# EAGLE design LIXIE_II (EAGLE 7.6.0)
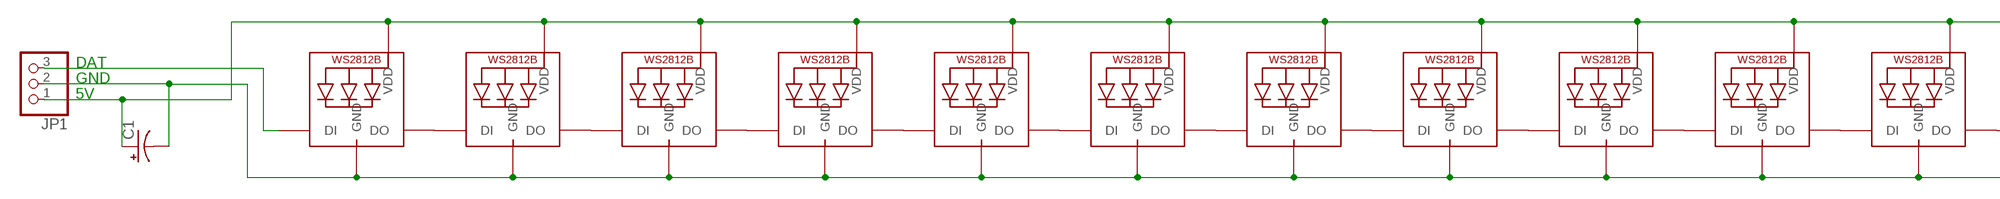
[diagram p0: schematic, sheet 1, part 1 of 2]
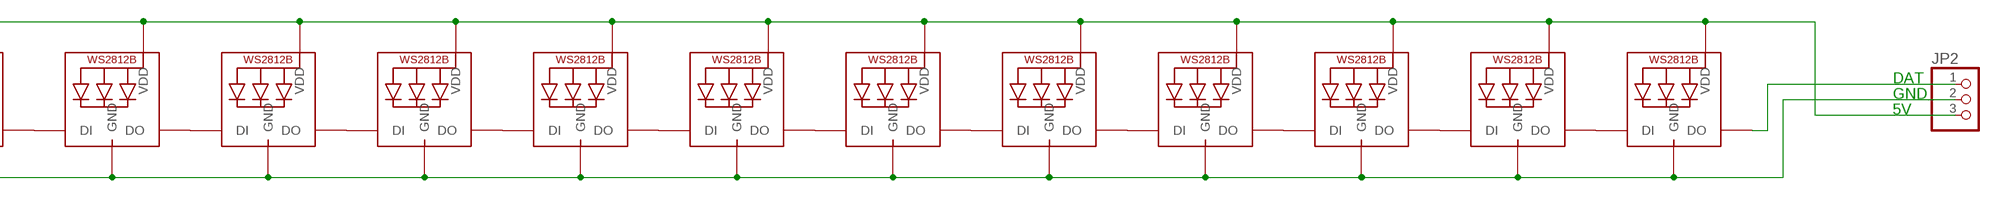
[diagram p1: schematic, sheet 1, part 2 of 2]

## Parts
C1  CPOL-USE5-10.5  [E5-10,5]
JP1  PINHD-1X3  [1X03]
JP2  PINHD-1X3  [1X03]
LED1  WS2812B_5050N  [WS2812B-NARROW]
LED2  WS2812B_5050N  [WS2812B-NARROW]
LED3  WS2812B_5050N  [WS2812B-NARROW]
LED4  WS2812B_5050N  [WS2812B-NARROW]
LED5  WS2812B_5050N  [WS2812B-NARROW]
LED6  WS2812B_5050N  [WS2812B-NARROW]
LED7  WS2812B_5050N  [WS2812B-NARROW]
LED8  WS2812B_5050N  [WS2812B-NARROW]
LED9  WS2812B_5050N  [WS2812B-NARROW]
LED10  WS2812B_5050N  [WS2812B-NARROW]
LED11  WS2812B_5050N  [WS2812B-NARROW]
LED12  WS2812B_5050N  [WS2812B-NARROW]
LED13  WS2812B_5050N  [WS2812B-NARROW]
LED14  WS2812B_5050N  [WS2812B-NARROW]
LED15  WS2812B_5050N  [WS2812B-NARROW]
LED16  WS2812B_5050N  [WS2812B-NARROW]
LED17  WS2812B_5050N  [WS2812B-NARROW]
LED18  WS2812B_5050N  [WS2812B-NARROW]
LED19  WS2812B_5050N  [WS2812B-NARROW]
LED20  WS2812B_5050N  [WS2812B-NARROW]
LED21  WS2812B_5050N  [WS2812B-NARROW]
LED22  WS2812B_5050N  [WS2812B-NARROW]

## Nets
5V: C1.+ JP1.1 JP2.3 LED1.1-VDD(VDD) LED2.1-VDD(VDD) LED3.1-VDD(VDD) LED4.1-VDD(VDD) LED5.1-VDD(VDD) LED6.1-VDD(VDD) LED7.1-VDD(VDD) LED8.1-VDD(VDD) LED9.1-VDD(VDD) LED10.1-VDD(VDD) LED11.1-VDD(VDD) LED12.1-VDD(VDD) LED13.1-VDD(VDD) LED14.1-VDD(VDD) LED15.1-VDD(VDD) LED16.1-VDD(VDD) LED17.1-VDD(VDD) LED18.1-VDD(VDD) LED19.1-VDD(VDD) LED20.1-VDD(VDD) LED21.1-VDD(VDD) LED22.1-VDD(VDD)
GND: C1.- JP1.2 JP2.2 LED1.3-GND(GND) LED2.3-GND(GND) LED3.3-GND(GND) LED4.3-GND(GND) LED5.3-GND(GND) LED6.3-GND(GND) LED7.3-GND(GND) LED8.3-GND(GND) LED9.3-GND(GND) LED10.3-GND(GND) LED11.3-GND(GND) LED12.3-GND(GND) LED13.3-GND(GND) LED14.3-GND(GND) LED15.3-GND(GND) LED16.3-GND(GND) LED17.3-GND(GND) LED18.3-GND(GND) LED19.3-GND(GND) LED20.3-GND(GND) LED21.3-GND(GND) LED22.3-GND(GND)
N$1: JP1.3 LED1.4-DIN(DI)
N$4: LED1.2-DOUT(DO) LED2.4-DIN(DI)
N$5: LED2.2-DOUT(DO) LED3.4-DIN(DI)
N$6: LED3.2-DOUT(DO) LED4.4-DIN(DI)
N$7: LED4.2-DOUT(DO) LED5.4-DIN(DI)
N$8: LED5.2-DOUT(DO) LED6.4-DIN(DI)
N$9: LED6.2-DOUT(DO) LED7.4-DIN(DI)
N$10: LED7.2-DOUT(DO) LED8.4-DIN(DI)
N$11: LED8.2-DOUT(DO) LED9.4-DIN(DI)
N$12: LED9.2-DOUT(DO) LED10.4-DIN(DI)
N$13: LED10.2-DOUT(DO) LED11.4-DIN(DI)
N$14: LED11.2-DOUT(DO) LED12.4-DIN(DI)
N$15: LED12.2-DOUT(DO) LED13.4-DIN(DI)
N$16: LED13.2-DOUT(DO) LED14.4-DIN(DI)
N$17: LED14.2-DOUT(DO) LED15.4-DIN(DI)
N$18: LED15.2-DOUT(DO) LED16.4-DIN(DI)
N$19: LED16.2-DOUT(DO) LED17.4-DIN(DI)
N$20: LED17.2-DOUT(DO) LED18.4-DIN(DI)
N$21: LED18.2-DOUT(DO) LED19.4-DIN(DI)
N$22: LED19.2-DOUT(DO) LED20.4-DIN(DI)
N$23: LED20.2-DOUT(DO) LED21.4-DIN(DI)
N$24: LED21.2-DOUT(DO) LED22.4-DIN(DI)
N$26: JP2.1 LED22.2-DOUT(DO)

## Notes on the sheet
- DAT
- GND | DAT
- 5V | GND
- 5V

## Library data of the parts
C1 = rcl:CPOL-US: POLARIZED CAPACITOR, American symbol
JP1 JP2 = pinhead:PINHD-1X3: PIN HEADER
LED1-LED22 = adafruit:WS2812B

## Board
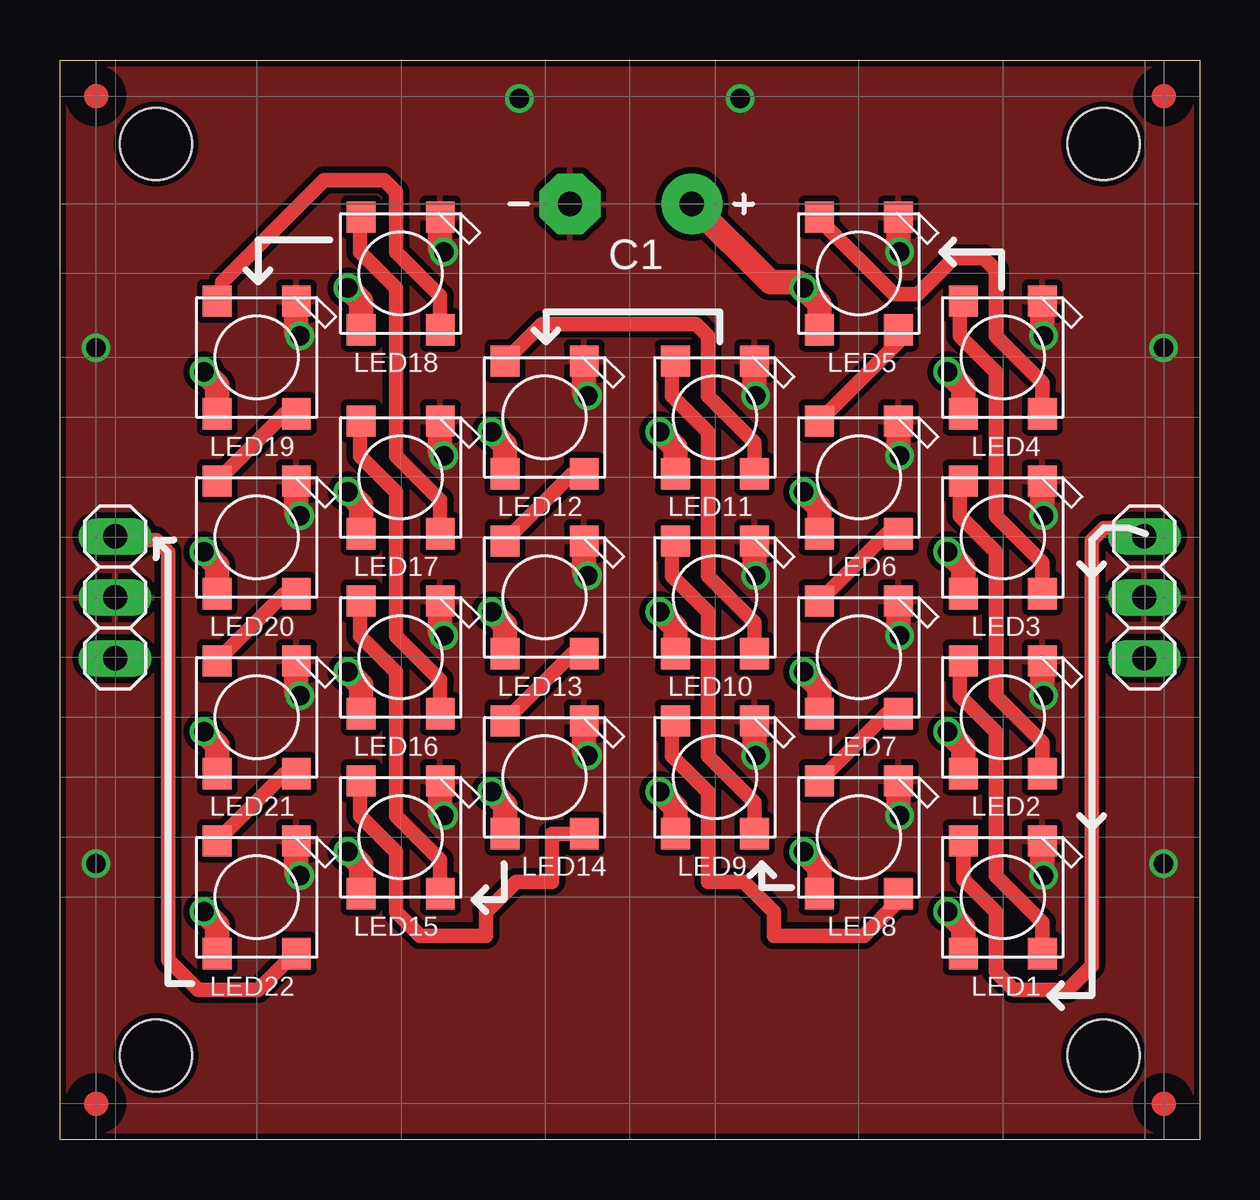
[diagram p2: board, top side]
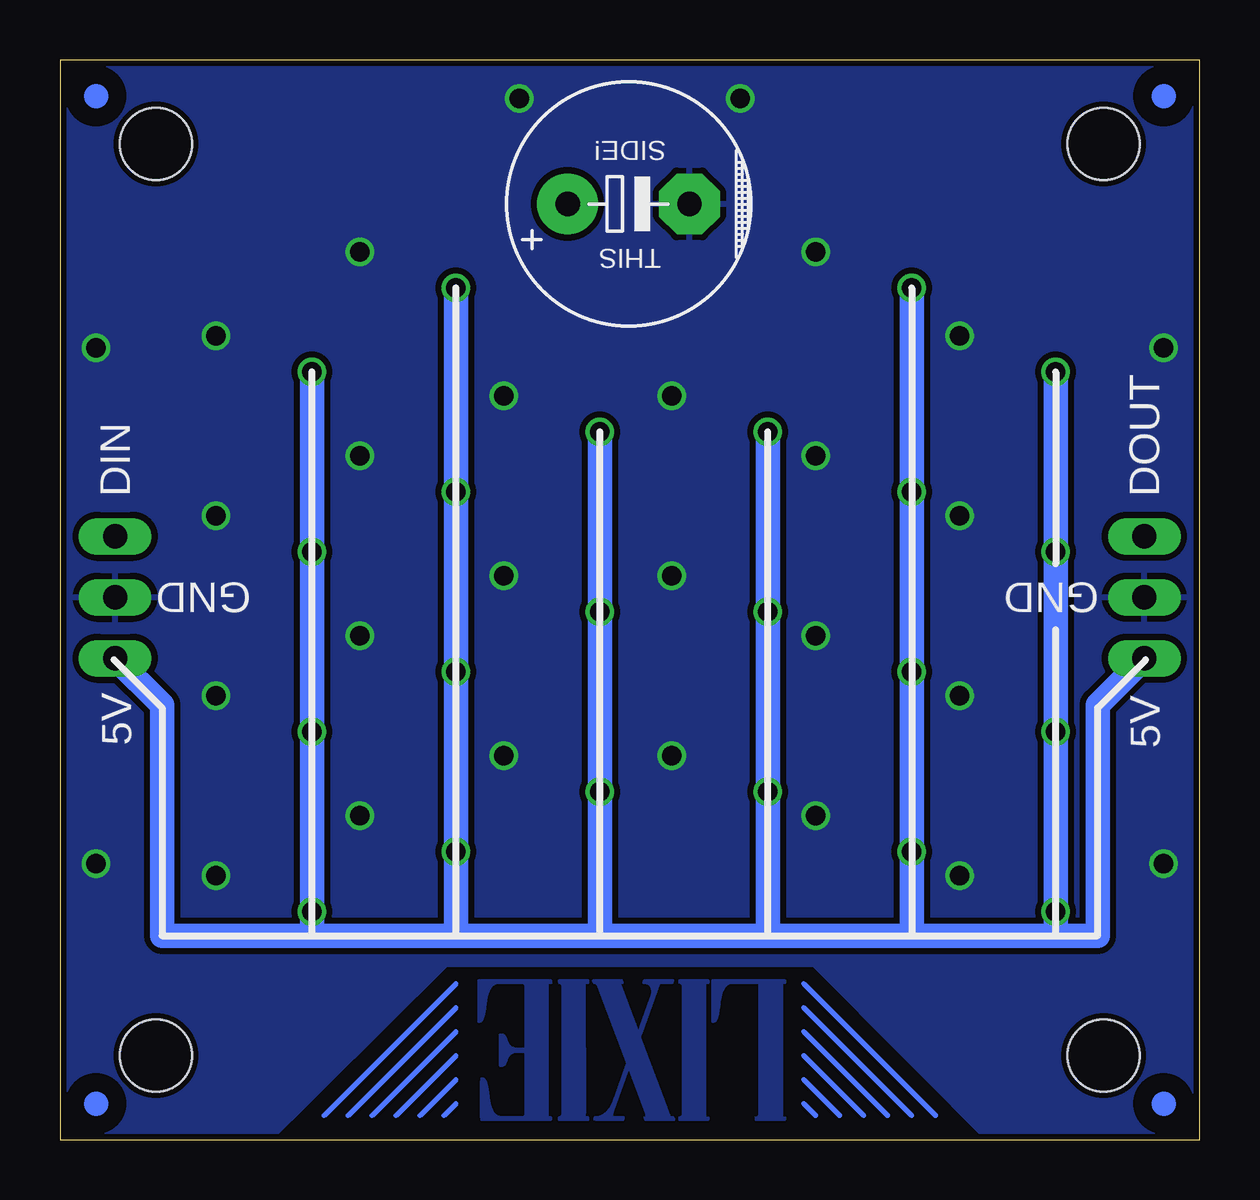
[diagram p3: board, bottom side, seen from below]

Size 47.5 x 45 mm. Coordinates in mm from the lower left corner, seen from the top.
Outline: 0,0 0,45 47.5,45 47.5,0 0,0
Copper layers (1*16): Top 0.035mm / dielectric 1.5mm / Bottom 0.035mm
Design rules "dirt_cheap_dirty_boards.v1.1": minimum track width 6mil, minimum drill 12mil, track to track 6mil, track to pad 6mil, pad to pad 6mil, via to via 6mil, smd to smd 0mil, copper to edge 10mil, drill to drill 10mil, minimum pad ring 10mil, minimum via ring 6mil, stop-mask expansion 2mil, vias tented up to drill 25mil, thermal gap 10mil
Holes 3 mm at 4,3.5 43.5,3.5 43.5,41.5 4,41.5

### Footprints (pad centres in the part's own frame; a part is rotated, then mirrored left to right if it is on the bottom)
E5-10,5 = drill 1.016 pad 2.54: + -2.54,0 | drill 1.016 pad 2.54 octagon: - 2.54,0
1X03 = drill 1.016 long: 1 -2.54,0; 2 0,0; 3 2.54,0
WS2812B-NARROW = smd 1.3 x 1.2: 1-VDD 2.35,-1.65; 2-DOUT 2.35,1.65; 3-GND -2.35,1.65; 4-DIN -2.35,-1.65

### Placement (x,y rotation side)
C1  23.8,39 180 top
JP1  45.2,22.6 90 top
JP2  2.3,22.6 270 top
LED1  39.3,10.1 270 top
LED2  39.3,17.6 270 top
LED3  39.3,25.1 270 top
LED4  39.3,32.6 270 top
LED5  33.3,36.1 270 top
LED6  33.3,27.6 270 top
LED7  33.3,20.1 270 top
LED8  33.3,12.6 270 top
LED9  27.3,15.1 270 top
LED10  27.3,22.6 270 top
LED11  27.3,30.1 270 top
LED12  20.2,30.1 270 top
LED13  20.2,22.6 270 top
LED14  20.2,15.1 270 top
LED15  14.2,12.6 270 top
LED16  14.2,20.1 270 top
LED17  14.2,27.6 270 top
LED18  14.2,36.1 270 top
LED19  8.2,32.6 270 top
LED20  8.2,25.1 270 top
LED21  8.2,17.6 270 top
LED22  8.2,10.1 270 top
U$1  [CIRCLE-1MM-2R]  1.5,1.5 0 top
U$2  [CIRCLE-1MM-2R]  1.5,43.5 0 top
U$3  [CIRCLE-1MM-2R]  46,43.5 0 top
U$4  [CIRCLE-1MM-2R]  46,1.5 0 top

### Tracks (layer width: path | path; a pad name or v marks a point on that pad's centre or on a via)
5V  (via drill 0.8)
  Top 1.016: LED1.1-VDD 37.65,8.85 v37,9.5 | LED2.1-VDD 37.65,16.35 v37,17 | LED3.1-VDD 37.65,23.85 v37,24.5 | LED4.1-VDD 37.65,31.35 v37,32 | LED5.1-VDD 31.65,34.85 v31,35.5 30.75,35.75 29.61,35.75 C1.+ | LED6.1-VDD 31.65,26.35 v31,27 | LED7.1-VDD 31.65,18.85 v31,19.5 | LED8.1-VDD 31.65,11.35 v31,12 | LED12.1-VDD 18.55,28.95 v18,29.5 | LED13.1-VDD 18.55,21.45 v18,22 | LED14.1-VDD 18.55,13.95 v18,14.5 | LED15.1-VDD 12.55,11.45 v12,12 | LED16.1-VDD 12.55,18.95 v12,19.5 | LED17.1-VDD 12.55,26.45 v12,27 | LED19.1-VDD 6.55,31.45 v6,32 | LED20.1-VDD 6.55,23.95 v6,24.5 | LED21.1-VDD 6.55,16.45 v6,17 | LED22.1-VDD 6.55,8.95 v6,9.5 | LED9.1-VDD 25.65,13.85 v25,14.5 | LED10.1-VDD 25.65,21.35 v25,22 | LED11.1-VDD 25.65,28.85 v25,29.5 | LED18.1-VDD 12.55,34.95 v12,35.5
  Bottom 1.016: JP1.1 43.25,18.11 43.25,8.5 37,8.5 | 37,8.5 31,8.5 | 31,8.5 25,8.5 | 25,8.5 18,8.5 | 18,8.5 12,8.5 | 12,8.5 6,8.5 | 6,8.5 4.25,8.5 4.25,18.11 JP2.3 | 37,8.5 v37,9.5 v37,17 v37,24.5 v37,32 | v31,35.5 v31,27 v31,19.5 v31,12 31,8.5 | 25,8.5 v25,14.5 v25,22 v25,29.5 | 18,8.5 v18,14.5 v18,22 v18,29.5 | 12,8.5 v12,12 v12,19.5 v12,27 v12,35.5 | 6,8.5 v6,9.5 v6,17 v6,24.5 v6,32
GND  (via drill 0.8)
  Top 1.016: LED22.3-GND 9.85,11.15 v10,11 | LED21.3-GND 9.85,18.65 v10,18.5 | LED20.3-GND 9.85,26.15 v10,26 | LED19.3-GND 9.85,33.65 v10,33.5 | LED18.3-GND 15.85,37.15 v16,37 | LED17.3-GND 15.85,28.65 v16,28.5 | LED16.3-GND 15.85,21.15 v16,21 | LED15.3-GND 15.85,13.65 v16,13.5 | LED14.3-GND 21.85,16.15 v22,16 | LED13.3-GND 21.85,23.65 v22,23.5 | LED12.3-GND 21.85,31.15 v22,31 | LED11.3-GND 28.95,31.05 v29,31 | LED10.3-GND 28.95,23.55 v29,23.5 | LED9.3-GND 28.95,16.05 v29,16 | LED8.3-GND 34.95,13.55 v35,13.5 | LED7.3-GND 34.95,21.05 v35,21 | LED6.3-GND 34.95,28.55 v35,28.5 | LED5.3-GND 34.95,37.05 v35,37 | LED4.3-GND 40.95,33.55 v41,33.5 | LED3.3-GND 40.95,26.05 v41,26 | LED2.3-GND 40.95,18.55 v41,18.5 | LED1.3-GND 40.95,11.05 v41,11
  other vias: 1.5,11.5 46,11.5 46,33 1.5,33 19.15,43.4 28.35,43.4
  pour Bottom (isolate 0.254): -0.5,45.5 -0.5,-0.5 8.4,-0.5 16.12,7.25 31.38,7.25 39.17,-0.5 48,-0.5 48,45.5
  pour Top (isolate 0.254): -1,46 48.5,46 48.5,-1 -1,-1
N$1
  Top 0.61: JP1.3 44.5,25.5 43.5,25.5 43,25 43,7.25 42,6.25 39.75,6.25 39,7 39,9.5 37.65,10.85 LED1.4-DIN
N$2
  pour Bottom: 25.47,0.79 25.47,0.79 25.46,0.8 25.45,0.81 25.45,0.83 25.44,0.87 25.45,0.91 25.45,0.94 25.46,0.95 25.47,0.95 25.47,0.96 25.58,0.97 25.58,1.17 25.58,6.49 25.47,6.5 25.46,6.5 25.46,6.51 25.45,6.53 25.44,6.59 25.44,6.61 25.45,6.64 25.46,6.65 25.46,6.66 25.47,6.66 25.47,6.67 25.48,6.67 25.63,6.68 26.52,6.68 26.69,6.67 26.69,6.67 26.72,6.66 26.73,6.65 26.73,6.63 26.74,6.58 26.73,6.51 26.72,6.51 26.72,6.5 26.71,6.5 26.69,6.49 26.63,6.47 26.62,6.47 26.61,6.46 26.61,6.45 26.6,6.44 26.59,6.37 26.59,1.1 26.6,1.03 26.61,1.01 26.61,1 26.62,0.99 26.63,0.98 26.7,0.96 26.72,0.95 26.73,0.95 26.73,0.94 26.73,0.93 26.74,0.9 26.73,0.82 26.73,0.81 26.73,0.81 26.73,0.81 26.73,0.8 26.72,0.8 26.72,0.79 26.71,0.79 26.69,0.78 26.65,0.78 25.64,0.78 25.63,0.78 25.48,0.78 25.48,0.78
N$3
  pour Bottom: 355 corners
N$4
  Top 0.61: LED1.2-DOUT 40.95,9.05 39,11 39,17 37.5,18.5 37.5,19.8 LED2.4-DIN
N$5
  Top 0.61: LED2.2-DOUT 40.95,16.55 39,18.5 39,24.5 37.5,26 37.5,27.3 LED3.4-DIN
N$6
  Top 0.61: LED3.2-DOUT 40.95,24.05 39,26 39,32 37.5,33.5 37.5,34.8 LED4.4-DIN
N$7
  Top 0.61: LED4.2-DOUT 40.95,31.55 39,33.5 39,36.25 38.5,36.75 37.25,36.75 35.75,35.25 34.75,35.25 31.65,38.35 LED5.4-DIN
N$8
  Top 0.61: LED5.2-DOUT 34.95,33.25 LED6.4-DIN
N$9
  Top 0.61: LED6.2-DOUT 34.45,25.25 LED7.4-DIN
N$10
  Top 0.61: LED7.2-DOUT 34.45,17.75 LED8.4-DIN
N$11
  Top 0.61: LED8.2-DOUT 34.95,9.95 33.5,8.5 29.75,8.5 29.75,9.5 28.5,10.75 27,10.75 27,14.5 25.5,16 25.5,17.3 LED9.4-DIN
N$12
  Top 0.61: LED9.2-DOUT 28.95,14.05 27,16 27,22 25.5,23.5 25.5,24.8 LED10.4-DIN
N$13
  Top 0.61: LED10.2-DOUT 28.95,21.55 27,23.5 27,29.5 25.5,31 25.5,32.3 LED11.4-DIN
N$14
  Top 0.61: LED11.2-DOUT 28.95,29.05 27,31 27,33.5 26.5,34 20.1,34 LED12.4-DIN
N$15
  Top 0.61: LED12.2-DOUT 21.35,27.75 LED13.4-DIN
N$16
  Top 0.61: LED13.2-DOUT 21.35,20.25 LED14.4-DIN
N$17
  Top 0.61: LED14.2-DOUT 20.5,12.75 20.5,10.75 19,10.75 17.75,9.5 17.75,8.5 15,8.5 14,9.5 14,12 12.5,13.5 12.5,14.9 LED15.4-DIN
N$18
  Top 0.61: LED15.2-DOUT 15.85,11.65 14,13.5 14,19.5 12.5,21 12.5,22.4 LED16.4-DIN
N$19
  Top 0.61: LED16.2-DOUT 15.85,19.15 14,21 14,27 12.5,28.5 12.5,29.9 LED17.4-DIN
N$20
  Top 0.61: LED17.2-DOUT 15.85,26.65 14,28.5 14,35.5 12.5,37 12.5,38.4 LED18.4-DIN
N$21
  Top 0.61: LED18.2-DOUT 15.85,35.15 14,37 14,39.5 13.5,40 11,40 6.75,35.75 6.75,35 6.7,34.95 LED19.4-DIN
N$22
  Top 0.61: LED19.2-DOUT 9.35,30.25 LED20.4-DIN
N$23
  Top 0.61: LED20.2-DOUT 9.35,22.75 LED21.4-DIN
N$24
  Top 0.61: LED21.2-DOUT 9.35,15.25 LED22.4-DIN
N$25
  pour Bottom: 17.26,0.79 17.26,0.8 17.25,0.81 17.25,0.82 17.24,0.87 17.24,0.92 17.25,0.94 17.25,0.95 17.26,0.95 17.27,0.96 17.36,0.97 17.36,1.15 17.36,6.29 17.36,6.48 17.27,6.49 17.26,6.5 17.26,6.5 17.25,6.51 17.25,6.52 17.24,6.53 17.24,6.59 17.24,6.63 17.25,6.65 17.26,6.66 17.26,6.66 17.27,6.67 17.27,6.67 17.28,6.67 17.44,6.68 20.12,6.68 20.29,6.67 20.32,6.67 20.35,6.64 20.35,6.48 20.35,5.08 20.35,4.91 20.35,4.9 20.34,4.89 20.33,4.88 20.3,4.87 20.29,4.87 20.29,4.87 20.28,4.87 20.27,4.87 20.27,4.87 20.25,4.87 20.24,4.88 20.23,4.88 20.21,4.89 20.2,4.89 20.19,4.9 20.18,4.91 20.16,4.92 20.15,4.93 20.14,4.94 20.14,4.95 20.13,4.96 20.12,4.96 20.1,5 20.05,5.15 20.05,5.18 20.04,5.2 20.03,5.23 20.03,5.26 20.02,5.28 20.01,5.34 20.01,5.39 19.98,5.63 19.96,5.76 19.95,5.82 19.94,5.87 19.94,5.89 19.93,5.92 19.88,6.09 19.85,6.17 19.83,6.22 19.78,6.31 19.75,6.35 19.73,6.37 19.72,6.39 19.7,6.4 19.69,6.41 19.67,6.43 19.6,6.47 19.57,6.48 19.56,6.48 19.54,6.49 19.53,6.49 19.52,6.49 18.39,6.49 18.39,1.2 18.39,1.04 18.41,0.99 18.51,0.95 18.51,0.95 18.52,0.95 18.52,0.94 18.53,0.93 18.53,0.92 18.53,0.91 18.54,0.84 18.53,0.83 18.53,0.82 18.52,0.81 18.51,0.8 18.5,0.79 18.49,0.78 18.48,0.78 18.33,0.78 17.42,0.78 17.27,0.79 17.27,0.79
N$26
  Top 0.61: LED22.2-DOUT 9.75,7.75 8.25,6.25 5.75,6.25 4.5,7.5 4.5,24.5 4,25 2.44,25 JP2.1
N$27
  pour Bottom: 20.45,0.79 20.45,0.8 20.44,0.81 20.44,0.82 20.43,0.87 20.43,0.92 20.44,0.94 20.45,0.95 20.45,0.95 20.46,0.96 20.57,0.97 20.57,6.49 20.46,6.49 20.46,6.5 20.46,6.5 20.45,6.5 20.45,6.5 20.45,6.51 20.44,6.51 20.44,6.52 20.44,6.52 20.43,6.53 20.43,6.55 20.43,6.61 20.44,6.63 20.44,6.65 20.45,6.66 20.46,6.66 20.46,6.67 20.47,6.67 20.48,6.67 20.64,6.68 21.62,6.68 21.63,6.68 21.68,6.67 21.69,6.67 21.7,6.66 21.71,6.66 21.71,6.65 21.71,6.65 21.71,6.65 21.72,6.64 21.72,6.62 21.72,6.57 21.72,6.54 21.72,6.53 21.71,6.51 21.71,6.5 21.61,6.47 21.59,6.46 21.58,6.41 21.58,6.24 21.58,1.22 21.58,1.05 21.59,1.01 21.61,0.99 21.7,0.95 21.71,0.95 21.71,0.94 21.72,0.93 21.72,0.87 21.72,0.83 21.72,0.81 21.71,0.8 21.7,0.79 21.7,0.79 21.68,0.79 21.56,0.78 20.63,0.78 20.54,0.78 20.46,0.79 20.46,0.79
N$28
  pour Bottom: 204 corners
N$29
  Bottom 0.2: 16.5,6.5 11,1
N$30
  Bottom 0.2: 12,1 16.5,5.5
N$31
  Bottom 0.2: 16.5,4.5 13,1
N$32
  Bottom 0.2: 14,1 16.5,3.5
N$33
  Bottom 0.2: 16.5,2.5 15,1
N$34
  Bottom 0.2: 16.5,1.5 16,1
N$35
  Bottom 0.2: 31,6.5 36.5,1
N$36
  Bottom 0.2: 31,5.5 35.5,1
N$37
  Bottom 0.2: 31,4.5 34.5,1
N$38
  Bottom 0.2: 31,3.5 33.5,1
N$39
  Bottom 0.2: 31,2.5 32.5,1
N$40
  Bottom 0.2: 31,1.5 31.5,1

### Text on the board
bPlace: SIDE! | THIS | DOUT | DIN | GND | GND | 5V | 5V
tStop: ANDREW / ROCKS | DESIGNED BY | CONNOR NISHIJIMA | TO PROVIDE FOR MY NEW WIFE | KATIE NISHIJIMA! | JUNE 8TH, 2019
bStop: LIXIE II / REV.1